# Altium schematic sheet EvoProject 1.0.SchDoc
size A3; CompanyName: INOVA Sistemas Eletrônicos LTDA.; DrawnBy: ***; Organization: INOVA Sistemas Eletrônicos LTDA.; Address1: Rua Antônio Gomes Maciel, 144; Address2: Bairro Kayser; Address3: Caxias do Sul - RS, Brasil; Address4: CEP: 95097-820; Revision: *.**
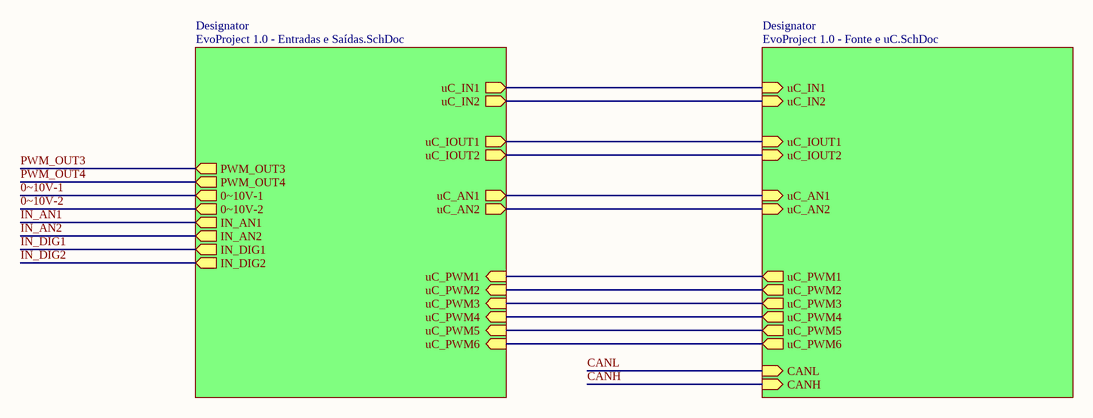
[diagram p0: EvoProject 1.0.SchDoc]

## Sub-sheets
Designator = EvoProject 1.0 - Entradas e Saídas.SchDoc: uC_IOUT1 (out), uC_IOUT2 (out), uC_AN1 (out), uC_AN2 (out), uC_PWM1 (in), uC_PWM2 (in), uC_PWM3 (in), uC_PWM4 (in), uC_PWM5 (in), uC_PWM6 (in), uC_IN1 (out), uC_IN2 (out), PWM_OUT3 (out), PWM_OUT4 (out), 0~10V-1 (out), 0~10V-2 (out), IN_AN1 (out), IN_AN2 (out), IN_DIG2 (out), IN_DIG1 (out)
Designator = EvoProject 1.0 - Fonte e uC.SchDoc: uC_IOUT1 (in), uC_IOUT2 (in), uC_AN1 (in), uC_AN2 (in), uC_PWM1 (out), uC_PWM2 (out), uC_PWM3 (out), uC_PWM4 (out), uC_PWM5 (out), uC_PWM6 (out), uC_IN1 (in), uC_IN2 (in), CANL (in), CANH (in)

## Nets
0~10V-1: sheet Designator/0~10V-1
0~10V-2: sheet Designator/0~10V-2
CANH: sheet Designator/CANH
CANL: sheet Designator/CANL
IN_AN1: sheet Designator/IN_AN1
IN_AN2: sheet Designator/IN_AN2
IN_DIG1: sheet Designator/IN_DIG1
IN_DIG2: sheet Designator/IN_DIG2
PWM_OUT3: sheet Designator/PWM_OUT3
PWM_OUT4: sheet Designator/PWM_OUT4
(unnamed): sheet Designator/uC_IOUT1, sheet Designator/uC_IOUT1
(unnamed): sheet Designator/uC_IOUT2, sheet Designator/uC_IOUT2
(unnamed): sheet Designator/uC_AN1, sheet Designator/uC_AN1
(unnamed): sheet Designator/uC_AN2, sheet Designator/uC_AN2
(unnamed): sheet Designator/uC_PWM1, sheet Designator/uC_PWM1
(unnamed): sheet Designator/uC_PWM2, sheet Designator/uC_PWM2
(unnamed): sheet Designator/uC_PWM3, sheet Designator/uC_PWM3
(unnamed): sheet Designator/uC_PWM4, sheet Designator/uC_PWM4
(unnamed): sheet Designator/uC_PWM5, sheet Designator/uC_PWM5
(unnamed): sheet Designator/uC_PWM6, sheet Designator/uC_PWM6
(unnamed): sheet Designator/uC_IN1, sheet Designator/uC_IN1
(unnamed): sheet Designator/uC_IN2, sheet Designator/uC_IN2

## Notes on the sheet
- Modelo:
- Formato:
- Criado:
- A3
- Responsável:
- Alterado:
- Revisão:
- Página:
- de
- Arquivo:
- Versão: